# Altium schematic sheet EnCoder.SchDoc
size A3; SheetNumber: 1; SheetTotal: 1
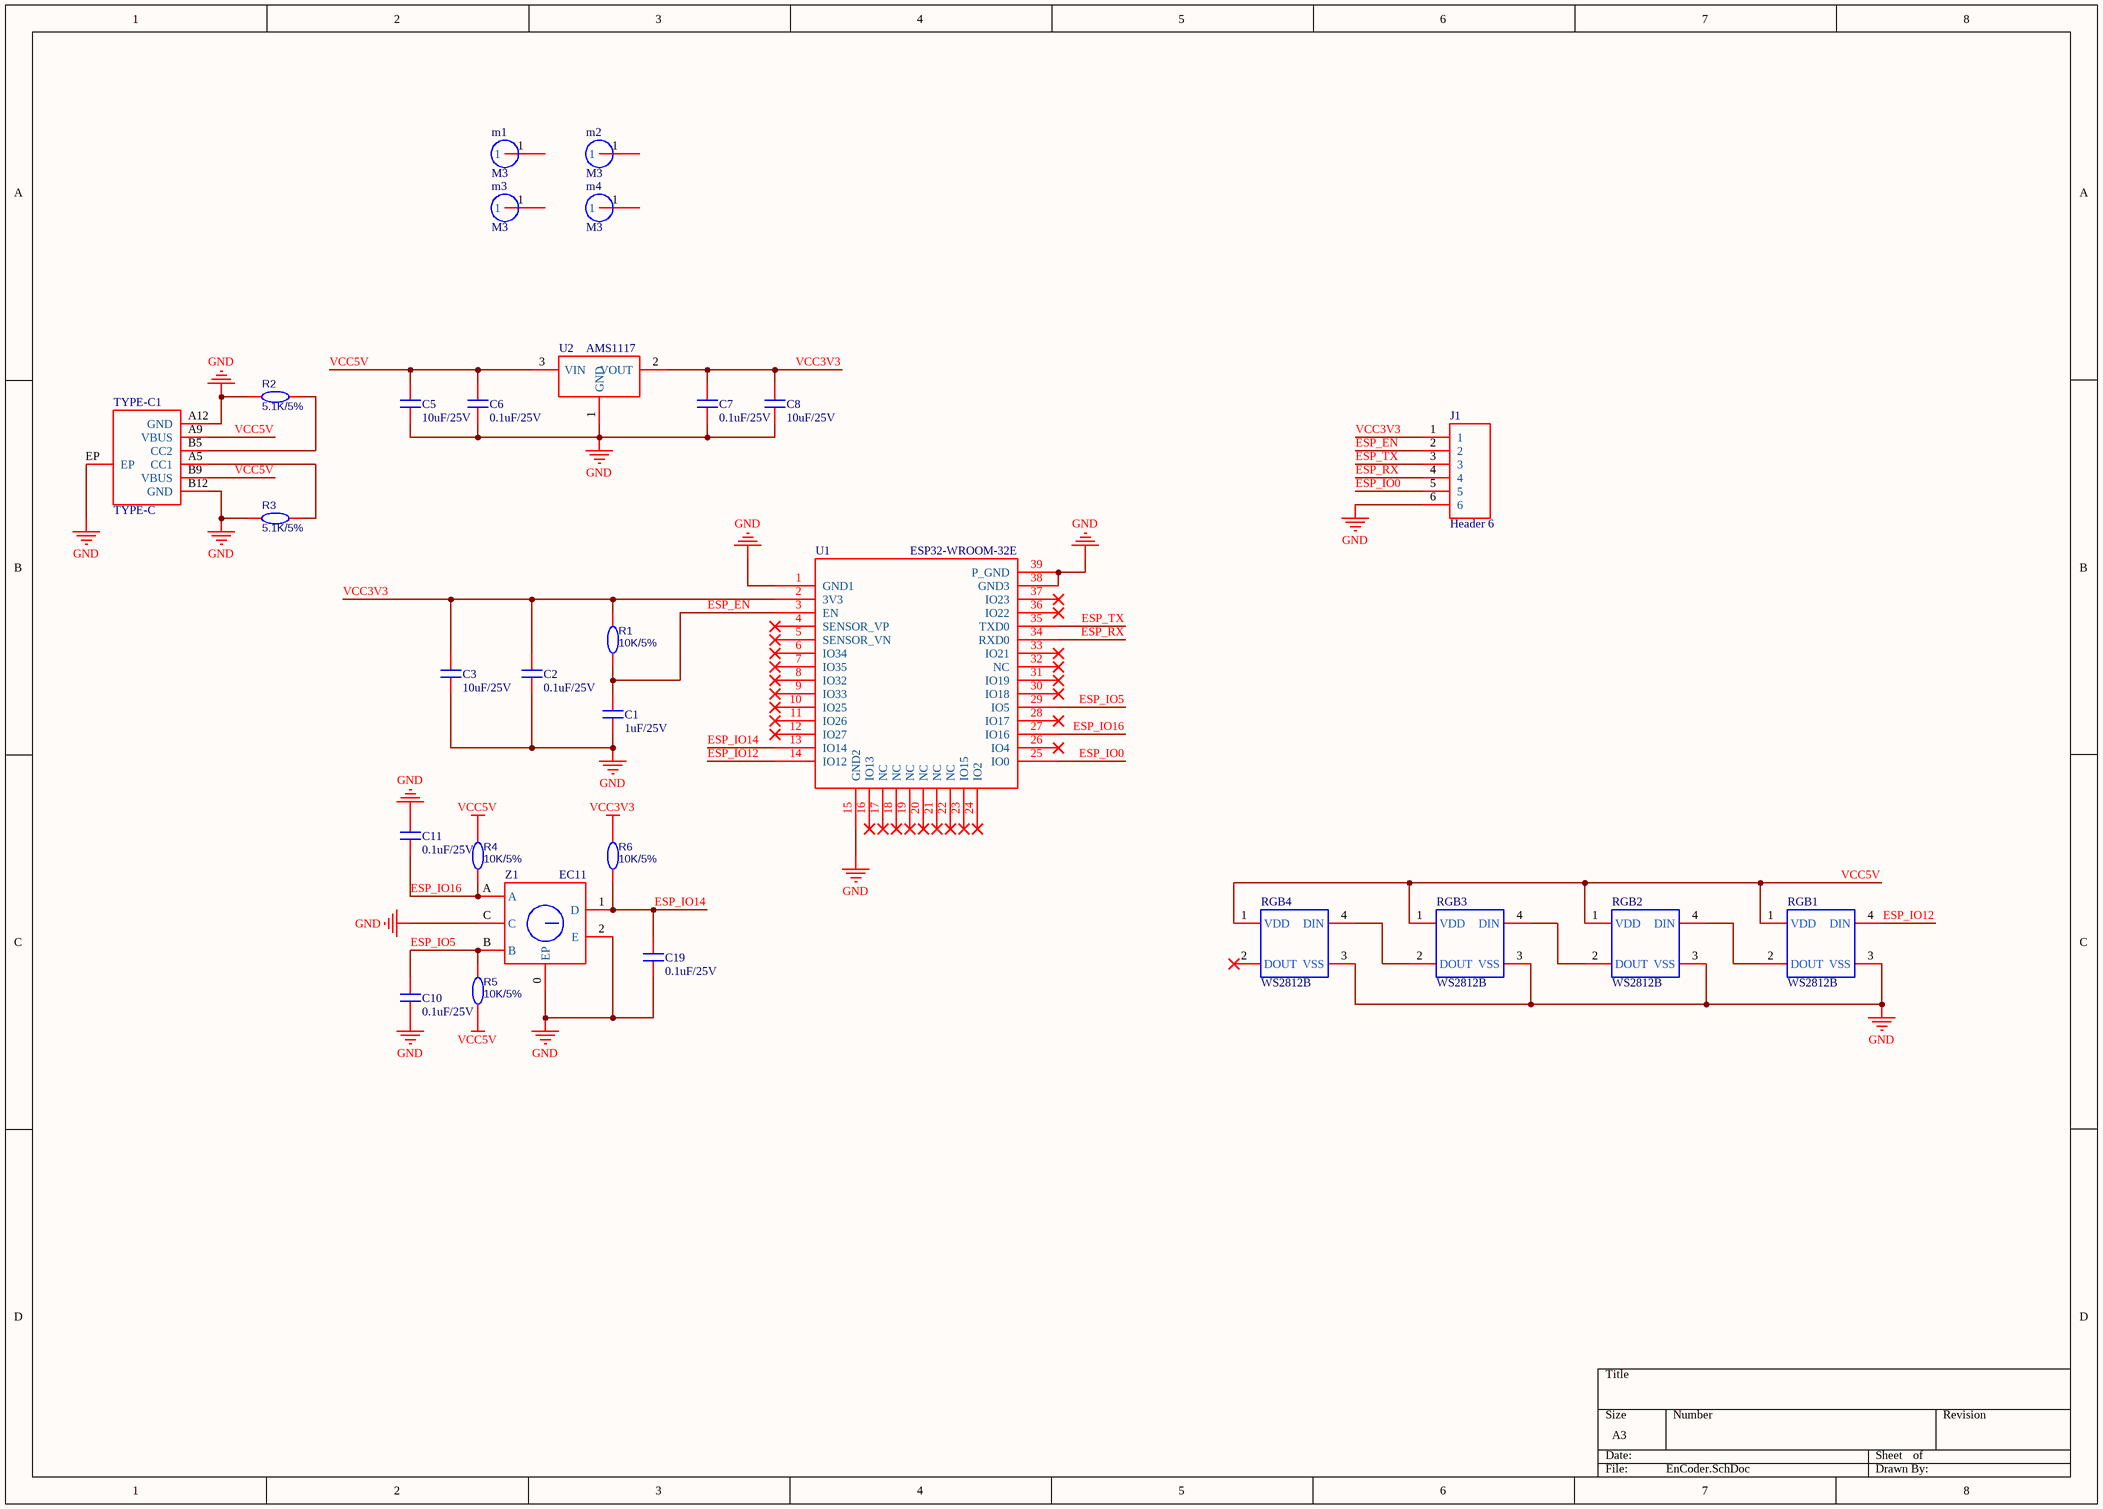
[diagram p0: EnCoder.SchDoc]

## Parts
C1  1uF/25V  [C 0805B]
C2  0.1uF/25V  [C 0805B]
C3  10uF/25V  [C 0805B]
C5  10uF/25V  [C 0805B]
C6  0.1uF/25V  [C 0805B]
C7  0.1uF/25V  [C 0805B]
C8  10uF/25V  [C 0805B]
C10  0.1uF/25V  [C 0805B]
C11  0.1uF/25V  [C 0805B]
C19  0.1uF/25V  [C 0805B]
J1  Header 6  [Header6]
m1  M3  [M3]
m2  M3  [M3]
m3  M3  [M3]
m4  M3  [M3]
R1  10K/5%  [R 0805]
R2  5.1K/5%  [R 0805]
R3  5.1K/5%  [R 0805]
R4  10K/5%  [R 0805]
R5  10K/5%  [R 0805]
R6  10K/5%  [R 0805]
RGB1  WS2812B  [RGBLED5050-4]
RGB2  WS2812B  [RGBLED5050-4]
RGB3  WS2812B  [RGBLED5050-4]
RGB4  WS2812B  [RGBLED5050-4]
TYPE-C1  TYPE-C  [TYPE-C-6P]
U1  ESP32-WROOM-32E  [ESP32-WROOM-32E]
U2  AMS1117  [SOT223_L]
Z1  EC11  [EC11-SMD]

## Nets
GND: C1.1 C2.1 C3.1 C5.1 C6.1 C7.1 C8.1 C10.2 C11.1 C19.2 J1.6 R2.2 R3.2 RGB1.3(VSS) RGB2.3(VSS) RGB3.3(VSS) RGB4.3(VSS) TYPE-C1.A12(GND) TYPE-C1.B12(GND) TYPE-C1.EP U1.1(GND1) U1.15(GND2) U1.38(GND3) U1.39(P_GND) U2.1(GND) Z1.0(EP) Z1.2(E) Z1.C
VCC3V3: C2.2 C3.2 C7.2 C8.2 J1.1 R1.2 R6.1 U1.2(3V3) U2.2(VOUT)
VCC5V: C5.2 C6.2 R4.1 R5.2 RGB1.1(VDD) RGB2.1(VDD) RGB3.1(VDD) RGB4.1(VDD) TYPE-C1.A9(VBUS) TYPE-C1.B9(VBUS) U2.3(VIN)
ESP_EN: C1.2 J1.2 R1.1 U1.3(EN)
ESP_IO0: J1.5 U1.25(IO0)
ESP_IO5: C10.1 R5.1 U1.29(IO5) Z1.B
ESP_IO12: RGB1.4(DIN) U1.14(IO12)
ESP_IO14: C19.1 R6.2 U1.13(IO14) Z1.1(D)
ESP_IO16: C11.2 R4.2 U1.27(IO16) Z1.A
ESP_RX: J1.4 U1.34(RXD0)
ESP_TX: J1.3 U1.35(TXD0)
NetR2_1: R2.1 TYPE-C1.B5(CC2)
NetR3_1: R3.1 TYPE-C1.A5(CC1)
NetRGB1_2: RGB1.2(DOUT) RGB2.4(DIN)
NetRGB2_2: RGB2.2(DOUT) RGB3.4(DIN)
NetRGB3_2: RGB3.2(DOUT) RGB4.4(DIN)

Not connected (* = marked no-connect by the designer): m1 1; m2 1; m3 1; m4 1; RGB4 2(DOUT)*; U1 4(SENSOR_VP)* 5(SENSOR_VN)* 6(IO34)* 7(IO35)* 8(IO32)* 9(IO33)* 10(IO25)* 11(IO26)* 12(IO27)* 16(IO13)* 17(NC)* 18(NC)* 19(NC)* 20(NC)* 21(NC)* 22(NC)* 23(IO15)* 24(IO2)* 26(IO4)* 28(IO17)* 30(IO18)* 31(IO19)* 32(NC)* 33(IO21)* 36(IO22)* 37(IO23)*

## Library data of the parts
C1-C3 C5-C8 C10 C11 C19 = C 0805: 贴片电容
J1 = Header 6: 端子
m1-m4 = M3: M3螺丝
R1-R6 = R 0603: 贴片电阻; BOM_Manufacturer: RALEC; BOM_Manufacturer Part: RTT021202FTH; nameAlias: Resistance (Ohms); BOM_Supplier: LCSC; BOM_Supplier Part: C102781; spicePre: R; spiceSymbolName: RTT021202FTH
RGB1-RGB4 = WS2812B: WS2812B灯珠
TYPE-C1 = TYPE-C-6
U1 = ESP32-WROOM-32E: ESP32模块
U2 = AMS1117: IC LDO
Z1 = EC11: 编码器; pin to pad: 0>EP 1>D 2>E